# Altium schematic sheet Power.SchDoc
size A
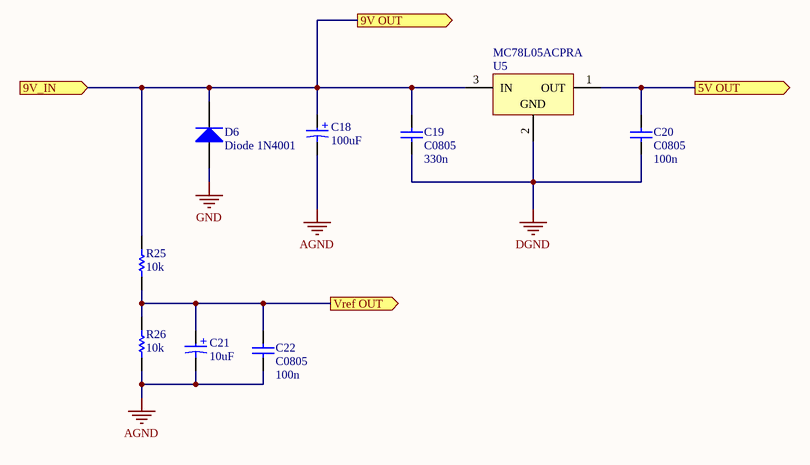
[diagram p0: Power.SchDoc]

## Parts
C18  value 100uF  [100uF CAP 2.5mm]  (hidden comment: CAP ELEC 100uF)
C19  C0805  value 330n  [0805]
C20  C0805  value 100n  [0805]
C21  value 10uF  [CAP 10uF]  (hidden comment: CAP ELEC 10uF)
C22  C0805  value 100n  [0805]
D6  Diode 1N4001  [DO-41]
R25  10k  [ERA-0805]
R26  10k  [ERA-0805]
U5  MC78L05ACPRA  [29-04]

## Ports
5V OUT (out), 9V OUT (out), 9V_IN (in), Vref OUT (out)

## Nets
AGND: C18.2 C21.2 C22.1 R26.1
DGND: C19.1 C20.1 U5.2(GND)
GND: D6.1(A)
5V OUT: C20.2 U5.1(OUT) ; port 5V OUT
9V OUT: C18.1 C19.2 D6.2(K) R25.2 U5.3(IN) ; port 9V OUT, port 9V_IN
Vref OUT: C21.1 C22.2 R25.1 R26.2 ; port Vref OUT

## Notes on the sheet
- (in symbol CAP ELEC 10uF) +
- (in symbol CAP ELEC 100uF) +

## Library data of the parts
C18 = CAP ELEC 100uF: MPN: UFW1E101MED1TD; Manufacturer: Nichicon; Voltage Rating: 25V; Height: 11mm
C19 C20 C22 = C0805: Ceramic Chip Capacitor - Standard; Note: Footprint corresponds to dimensions for bulk cassette packaging. This case size has tightened tolerances.; Published: 17-Jul-2002; LatestRevisionDate: 19-Mar-2004; LatestRevisionNote: Silkscreen size reduced.; DatasheetDocument: Mar-2001; PackageDocument: Mar-2001; PackageReference: 0805; Publisher: Altium Limited; Code_JEITA: 0805; Code_IPC: 2012[0805]; ComponentLink1Description: Manufacturer Link; ComponentLink1URL: http://www.kemet.com/; ComponentLink2Description: Datasheet; ComponentLink2URL: http://www.kemet.com/kemet/web/homepage/kechome.nsf/vapubfilesname/F3102TA.pdf/$file/F3102TA.pdf
C21 = CAP ELEC 10uF: MPN: USR1E100MDD1TE; Manufacturer: Nichicon; Voltage Rating: 25V; Height: 11mm
D6 = Diode 1N4001: 1 Amp General Purpose Rectifier; Published: 8-Jun-2000; LatestRevisionDate: 17-Jul-2002; LatestRevisionNote: Re-released for DXP Platform.; DatasheetVersion: 1998; PackageVersion: Aug-1999; PackageReference: DO-41; Publisher: Altium Limited; PackageDescription: Diode, Axial; Body 5.2 x 2.7 mm (LxDia. max), Lead Dia. 0.86 mm (max); Code_JEDEC: DO-204-AL; ComponentLink1Description: Manufacturer Link; ComponentLink1URL: http://www.fairchildsemi.com/; ComponentLink2Description: Datasheet; ComponentLink2URL: http://www.fairchildsemi.com/ds/1N%2F1N4001.pdf
R25 R26 = ERAS: Metal Film Thermosensitive Chip Resistor, 0.56 Ohm to 10k Ohm Range, 5% Tolerance, 0805 Size, 0.1 W; Note: If flow soldering, adjust pad width of PCB Footprint to 0.7 - 0.8 times the width of the resistor.; Published: 17-Dec-2003; LatestRevisionDate: 19-Mar-2004; LatestRevisionNote: Silkscreen size reduced.; PackageDocument: Mar-2003; PackageReference: ERA-0805; Publisher: Altium Limited; Code_IPC: 2012 [0805]; ComponentLink1Description: Manufacturer Link; ComponentLink1URL: http://www.panasonic.com/industrial/components/resistive_products.htm; ComponentLink2Description: Datasheet; ComponentLink2URL: http://www.panasonic.com/industrial/components/pdf/AOF0000CE1.pdf
U5 = MC78L05ACPRA: Three-Terminal Low Current Positive Voltage Regulator; Published: 15-Apr-2002; DatasheetVersion: Oct-1999; PackageVersion: 1996; PackageReference: 29-04; Publisher: Altium Limited; PackageDescription: TO, Flat Index; 3 In-Line, Axial Leads; Body Dia. 4.8mm; Leads 0.48 x 0.51 mm (max); ComponentLink1Description: Manufacturer Link; ComponentLink1URL: http://www.onsemi.com/site/products/taxonomy/0,4438,503,00.html; ComponentLink2Description: Datasheet; ComponentLink2URL: http://www.onsemi.com/pub/Collateral/MC78L00A-D.PDF